# EasyEDA Pro project V0.2-Umbilical-ADXL-1.epro

# Board PCB1
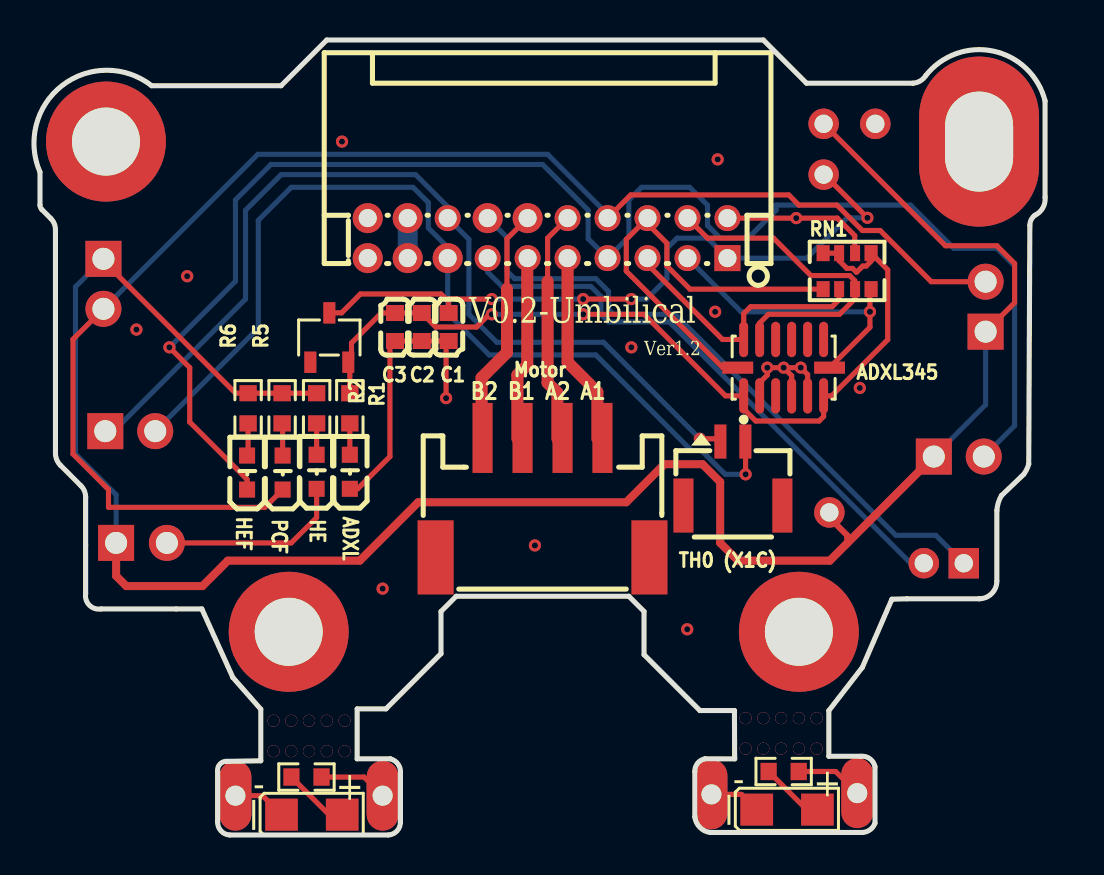
[diagram p0: board, top side]
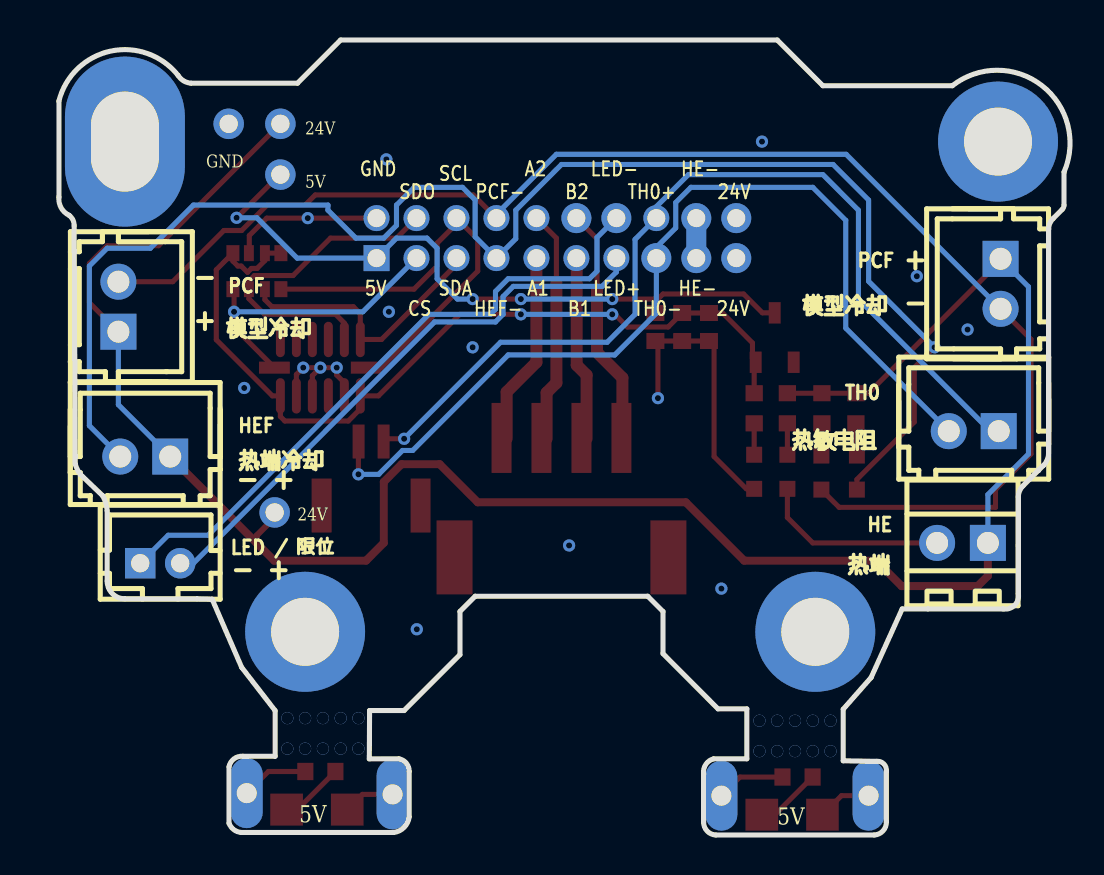
[diagram p1: board, bottom side, seen from below]

Outline 50.6 x 39.75 mm; copper layers: Top Layer, Bottom Layer. Coordinates in mm from the lower left corner of the outline.
Outline path: 0.3,33.15 0.3,31.5 arc(0.32,31.38) 0.39,31.28 0.84,30.83 arc(1.01,30.57) 1.08,30.26 1.08,19.09 arc(1.14,18.76) 1.33,18.49 2.35,17.46 arc(2.53,17.2) 2.59,16.89 2.59,12.06 arc(2.77,11.49) 3.35,11.3 8.4,11.3 9.95,7.87 11.35,6.29 11.35,3.71 9.7,3.68 arc(9.32,3.56) 9.19,3.19 9.19,0.65 arc(9.36,0.2) 9.79,0 17.72,0 arc(18.16,0.2) 18.33,0.64 18.33,3.06 arc(18.22,3.53) 17.83,3.81 16.17,3.81 16.17,6.31 17.61,6.31 20.37,9.07 20.37,11.18 21.13,11.94 29.76,11.94 30.53,11.18 30.53,9.02 33.32,6.22 35.05,6.22 35.06,3.81 33.57,3.81 arc(33.2,3.59) 33.07,3.17 33.07,0.91 arc(33.32,0.38) 33.84,0.13 41.47,0.13 arc(41.85,0.27) 42.08,0.59 42.08,3.41 arc(41.84,3.81) 41.39,3.94 39.77,3.94 39.77,6.22 41.45,8.38 42.93,11.79 43.68,11.81 47.29,11.81 arc(47.92,12.07) 48.18,12.7 48.18,16.22 arc(48.25,16.61) 48.41,16.97 49.53,18.04 arc(49.67,18.28) 49.77,18.55 49.83,30.48 arc(49.9,30.76) 50.08,30.99 arc(50.48,31.36) 50.59,31.89 50.59,36.7 arc(48,39.2) 44.62,37.97 arc(44.35,37.71) 43.99,37.59 38.65,37.59 36.5,39.75 14.65,39.75 12.37,37.47 5.89,37.47 arc(1.42,37.48) 0.3,33.15
Stack: Top Layer 0.035mm / Dielectric1 1.51mm FR4 er 4.5 / Bottom Layer 0.035mm

## Design rules (mm)
template: 自定义配置
spacing copperThickness1oz (default): track to track 0.102, other pairs 0.152 to 0.3
spacing copperThickness2oz: track to track 0.203, other pairs 0.152 to 0.3
track width copperThickness1oz (default): min 0.127, default 0.254, max 2.54
track width copperThickness2oz: min 0.203, default 0.254, max 2.54
differential pair differentialPair (default): width min 0.127, default 0.254, max 2.54; gap min 0.152, default 0.152
via viaSize (default): diameter min 0.5, default 0.61, max 10; hole min 0.3, default 0.305, max 6.3

## Placement (name value [footprint] x y rotation side)
ADXL345  ADXL345BCCZ  [LGA-14_L5.0-W3.0-P0.80-BL]  37.51 23.37 0 top
C1  4.7uF  [C0603]  20.75 25.4 90 top
C2  10uF  [C0603]  19.41 25.4 90 top
C3  100nF  [C0603]  18.07 25.4 90 top
CN1  M2026R-2x10P  [conn-th_10p-m2026r-2-10p]  25.7 29.84 0 top
HE  DB125-2.54-2P-GN-S  [CONN-TH_DB125-2.54-2P-GN]  5.38 14.61 0 bottom
HEF  HX25003-2A  [CONN-TH_2P-P2.50_HX25003-2A]  46.27 18.92 0 bottom
LED1  NCD0603R3  [LED0603-R-RD_RED]  15.8 18.16 90 top
LED2  NCD0603R3  [LED0603-R-RD_RED]  14.14 18.16 90 top
LED3  NCD1206Y1  [LED1206-RD]  13.91 1.02 0 top
LED4  NCD1206Y1  [LED1206-RD]  37.68 1.27 0 top
LED5  NCD0603R3  [LED0603-R-RD_RED]  12.44 18.12 90 top
LED6  NCD0603R3  [LED0603-R-RD_RED]  10.66 18.12 90 top
LED / 限位  HDGC2001WV-2P  [CONN-TH_2P-P2.00_HDGC_HDGC2001WV-2P]  45.52 13.59 180 bottom
Motor  S4B-PH-SM4-TB(LF)(SN)  [CONN-SMD_S4B-PH-SM4-TB-LF-SN]  25.45 16.87 180 top
NOREF  -  [Pad_e99]  33.9 2.03 0 top
NOREF#2  -  [Pad_e43]  3.6 34.67 0 top
NOREF#3  -  [Pad_e1]  42.1 35.56 0 top
NOREF#4  -  [Pad_e44]  47.29 34.67 0 top
NOREF#5  -  [Pad_e39]  12.75 10.16 0 top
NOREF#6  -  [Pad_e4]  39.51 35.56 0 top
NOREF#7  -  [Pad_e100]  41.19 2.09 0 top
NOREF#8  -  [Pad_e41]  38.27 10.16 0 top
NOREF#9  -  [Pad_e810]  39.51 33.02 0 top
NOREF#10  -  [Pad_e232]  39.8 16.13 0 top
NOREF#11  -  [Pad_e95]  10.08 1.97 0 top
NOREF#12  -  [Pad_e98]  17.45 1.97 0 top
PCF  -  [CONN-TH_2P-P2.50_HX25003-2A]  3.48 27.56 270 bottom
PCF#2  -  [CONN-TH_2P-P2.50_HX25003-2A]  47.62 26.42 90 bottom
R1  1K  [R0603]  15.8 21.34 270 top
R2  10K  [R0603]  14.14 21.34 270 top
R3  470  [R0603]  13.64 2.9 180 top
R4  470  [R0603]  37.51 3.17 180 top
R5  10K  [R0603]  12.42 21.34 270 top
R6  10K  [R0603]  10.71 21.34 270 top
RN1  10kΩ  [RES-ARRAY-SMD_0603-8P-L3.2-W1.6-BL]  40.69 28.19 0 top
TH0  HX25003-2A  [CONN-TH_2P-P2.50_HX25003-2A]  4.82 20.19 0 bottom
TH0 (X1C)  L125WVS-02PW  [CONN-SMD_2P-P1.25_DELON_L125WVS-02PW]  34.97 18.07 0 top
U1  ME6206A33XG  [SOT-23-3_L2.9-W1.6-P1.90-LS2.8-BR]  14.78 24.87 270 top

## Footprints (pads in the part's own frame, mm; a bottom-side part is the same pattern mirrored in y, then rotated)
C0603
  rect 0.8x0.9 smd: 1(-0.7,0) 2(0.7,0)
CONN-SMD_2P-P1.25_DELON_L125WVS-02PW
  rect 0.6x1.7 smd: 1(-0.625,1.6) 2(0.625,1.6)
  rect 1x2.7 smd: 3(2.475,-1.6) 4(-2.475,-1.6)
CONN-SMD_S4B-PH-SM4-TB-LF-SN
  rect 1x3.5 smd: 1(3,-2.987) 2(1,-2.987) 3(-1,-2.987) 4(-3,-2.987)
  rect 1.8x3.7 smd: 5(-5.35,2.987) 6(5.35,2.987)
CONN-TH_2P-P2.00_HDGC_HDGC2001WV-2P
  rect 1.524x1.524 hole 0.914: 1(-1,0)
  round 1.524 hole 0.914: 2(1,0)
CONN-TH_2P-P2.50_HX25003-2A
  rect 1.8x1.8 hole 1.1: 1(-1.25,0)
  round 1.8 hole 1.1: 2(1.25,0)
conn-th_10p-m2026r-2-10p
  rect 1.3x1.3 hole 0.9: 1(9,-1)
  round 1.3 hole 0.9: 2(9,1) 3(7,-1) 4(7,1) 5(5,-1) 6(5,1) 7(3,-1) 8(3,1) 9(1,-1) 10(1,1) 11(-1,-1) 13(-3,-1) 16(-5,1)
  round 1.5 hole 0.9: 12(-1,1) 14(-3,1) 15(-5,-1) 17(-7,-1) 18(-7,1) 19(-9,-1) 20(-9,1)
CONN-TH_DB125-2.54-2P-GN
  rect 1.8x1.8 hole 1.1: 1(-1.27,0)
  round 1.8 hole 1.1: 2(1.27,0)
LED0603-R-RD_RED
  rect 0.8x0.8 smd: 1(0.851,0) 2(-0.851,0)
LED1206-RD
  rect 1.635x1.6 smd: 1(-1.518,0) 2(1.518,0)
LGA-14_L5.0-W3.0-P0.80-BL
  oval 0.448x1.769 smd: 1(-2,-1.409) 2(-1.2,-1.409) 3(-0.4,-1.409) 4(0.4,-1.409) 5(1.2,-1.409) 6(2,-1.409) 8(2,1.409) 9(1.2,1.409) 10(0.4,1.409) 11(-0.4,1.409) 12(-1.2,1.409) 13(-2,1.409)
  rect 1.545x0.6 smd: 7(2.297,0) 14(-2.297,0)
Pad_e1
  round 1.524 hole 0.914: 22(0,0)
Pad_e4
  round 1.524 hole 0.914: 23(0,0)
Pad_e39
  round 6 hole 3.4: 1(0,0)
Pad_e41
  round 6 hole 3.4: 1(0,0)
Pad_e43
  round 6 hole 3.4: 1(0,0)
Pad_e44
  oval 6x8.5 hole 3.4x5: 1(0,0)
Pad_e95
  rrect 1.6x3.5 hole 1: 21(0,0)
Pad_e98
  rrect 1.6x3.5 hole 1: 21(0,0)
Pad_e99
  rrect 1.6x3.5 hole 1: 21(0,0)
Pad_e100
  rrect 1.6x3.5 hole 1: 21(0,0)
Pad_e232
  round 1.524 hole 0.914: 23(0,0)
Pad_e810
  round 1.524 hole 0.914: 24(0,0)
R0603
  rect 0.806x0.864 smd: 1(-0.753,0) 2(0.753,0)
RES-ARRAY-SMD_0603-8P-L3.2-W1.6-BL
  rect 0.65x0.8 smd: 1(-1.2,-0.9) 4(1.2,-0.9) 5(1.2,0.9) 8(-1.2,0.9)
  rect 0.5x0.8 smd: 2(-0.4,-0.9) 3(0.4,-0.9) 6(0.4,0.9) 7(-0.4,0.9)
SOT-23-3_L2.9-W1.6-P1.90-LS2.8-BR
  rect 1.07x0.6 smd: 1(1.235,-0.95) 2(1.235,0.95) 3(-1.235,0)

## Nets
3V3: ADXL345.1 ADXL345.6 C2.2 C3.2 R1.1 RN1.5 RN1.7 RN1.8 U1.2
24V: CN1.19 CN1.20 HE.1 HEF.1 NOREF#6.23 NOREF#10.23 PCF.1 PCF#2.1 R2.1 R5.1 R6.1
+5V: C1.2 CN1.1 NOREF#9.24 U1.3
GND: ADXL345.2 ADXL345.4 ADXL345.5 C1.1 C2.1 C3.1 CN1.2 LED1.2 NOREF#3.22 RN1.6 U1.1
+: NOREF#7.21 NOREF#12.21 R3.1 R4.1
-: LED3.1 LED4.1 NOREF.21 NOREF#11.21
A1: CN1.9 Motor.4
A2: CN1.10 Motor.3
B1: CN1.11 Motor.2
B2: CN1.12 Motor.1
CS: ADXL345.7 CN1.3 RN1.4
HE-: CN1.17 CN1.18 HE.2 LED2.2
HEF-: CN1.7 HEF.2 LED6.2
LED+: CN1.13 LED / 限位.2
LED-: CN1.14 LED / 限位.1
PCF-: CN1.8 LED5.2 PCF.2 PCF#2.2
SCL: ADXL345.14 CN1.6 RN1.1
SDA: ADXL345.13 CN1.5 RN1.2
SDO: ADXL345.12 CN1.4 RN1.3
TH0+: CN1.16 TH0.1 TH0 (X1C).1
TH0-: CN1.15 TH0.2 TH0 (X1C).2
$1N2303: LED1.1 R1.2
$1N2329: LED2.1 R2.2
$1N2496: LED3.2 R3.2
$1N2522: LED4.2 R4.2
$1N2656: LED5.1 R5.2
$1N2658: LED6.1 R6.2

Pads without a net: ADXL345 3 8 9 10 11; Motor 5 6; NOREF#2 1; NOREF#4 1; NOREF#5 1; NOREF#8 1; TH0 (X1C) 3 4

## Via types
v1: diameter 0.6, hole 0.6, Top Layer to Bottom Layer, 20 vias
v2: diameter 0.61, hole 0.305, Top Layer to Bottom Layer, 25 vias

## Routing (per net, layer and track width the routed paths; a pad name or vN(x,y) marks a point on that pad's centre or on a via; arc(x,y) is an arc through that point)
3V3: length 43.8
  Top Layer w0.254: v2(27.48,26.04) 30.53,26.04 34.6,21.96 ADXL345.1 35.51,21.3 36.11,20.7 39.29,20.7 39.51,20.92 ADXL345.6 39.91,21.96 42.72,24.77 42.72,28.26 RN1.5 41.89,28.69 41.64,28.45 41.47,28.45 41.17,28.15 41.14,28.15 40.96,28.33 40.68,28.33 40.29,28.72 RN1.7 RN1.8 ; R1.1 15.8,23.56 U1.2 15.89,23.8 15.89,24.61 17.38,26.1 C3.2 C2.2 20.11,25.4 22.14,25.4 22.78,26.04 v2(22.91,26.04)
  Bottom Layer w0.254: v2(22.91,26.04) v2(27.48,26.04)
24V: length 106.1
  Top Layer w0.254: PCF#2.1 49.07,26.62 49.07,28.58 48.18,29.46 45.61,29.46 NOREF#6.23 ; R2.1 R5.1 R6.1 10.09,22.09 3.37,28.81 PCF.1
  Top Layer w0.3: 40.69,14.59 40.69,14.98 40.05,15.62 39.51,15.62
  Top Layer w0.4: HEF.1 39.82,13.72 35.23,13.72 34.34,14.61 34.34,17.65 33.45,18.54 31.54,18.54 29.64,16.64 19.22,16.64 16.3,13.72 9.7,13.72 8.43,12.45 4.62,12.45 4.11,12.95 HE.1
  Bottom Layer w0.254: HE.1 4.11,17.02 2.08,19.05 2.08,27.41 PCF.1 ; HEF.1 47.62,21.52 PCF#2.1
+5V: length 34.7
  Top Layer w0.254: v2(22.91,26.8) 20.62,26.8 ; 20.62,26.8 20.37,27.05 16.33,27.05 15.39,26.11 U1.3 ; 20.62,26.8 20.75,26.67 C1.2 ; NOREF#9.24 39.54,33.02 v2(41.7,30.86) ; v2(29.89,26.8) v2(27.48,26.8)
  Bottom Layer w0.254: v2(29.89,26.8) 30.65,26.8 31.67,27.81 31.67,29.34 32.18,29.84 33.7,29.84 CN1.1 38.67,28.84 40.69,30.86 v2(41.7,30.86) ; v2(22.91,26.8) v2(27.48,26.8)
GND: length 28.1
  Top Layer w0.254: CN1.2 v2(38.14,30.84) 40.19,30.84 41.07,29.97 41.07,29.11 RN1.6 ; 36.31,21.96 36.31,22.62 36.69,23 v2(36.69,23.37) v2(37.51,23.37) ; LED1.2 16.2,17.31 17.81,18.92 17.81,24.45 C3.1 C2.1 C1.1 20.62,24.57 v2(20.62,21.84) ; 37.91,21.96 37.91,22.97 v2(37.51,23.37) ; v2(37.51,23.37) v2(38.37,23.37) 38.71,23.02 ADXL345.5
  vias: v2(5.13,25.27) v2(7.67,27.94) v2(15.41,34.67) v2(17.45,12.32) v2(25.07,14.48) v2(29.89,24.38) v2(32.69,10.29) v2(34.08,26.16) v2(34.21,33.78) v2(41.32,22.35)
(no net):
  vias: v1(11.98,5.72) v1(11.98,4.19) v1(12.87,5.72) v1(12.87,4.19) v1(13.76,5.72) v1(13.76,4.19) v1(14.65,5.72) v1(14.65,4.19) v1(15.54,5.72) v1(15.54,4.19) v1(35.61,5.84) v1(35.61,4.32) v1(36.5,5.84) v1(36.5,4.32) v1(37.38,5.84) v1(37.38,4.32) v1(38.27,5.84) v1(38.27,4.32) v1(39.16,5.84) v1(39.16,4.32)
+: length 6.8
  Top Layer w0.254: R3.1 16.51,2.9 NOREF#12.21 ; R4.1 40.11,3.17 NOREF#7.21
-: length 5.3
  Top Layer w0.254: LED4.1 35.4,2.03 NOREF.21 ; NOREF#11.21 11.44,1.97 LED3.1
A1: length 9.6
  Top Layer w0.6: CN1.9 26.7,23.64 28.19,22.15 28.19,19.82
A2: length 11.6
  Top Layer w0.254: CN1.10 25.7,29.84 25.7,27.69
  Top Layer w0.6: 26.19,19.82 26.19,22.12 25.7,22.61 25.7,27.69
B1: length 9.2
  Top Layer w0.6: 24.19,19.82 24.19,23 24.68,23.5 24.68,28.83 CN1.11
B2: length 11.8
  Top Layer w0.254: CN1.12 23.67,29.81 23.67,27.31
  Top Layer w0.6: 22.4,20.03 22.4,22.86 23.67,24.13 23.67,27.31
CS: length 15
  Top Layer w0.254: ADXL345.7 41.83,25.39 v2(41.83,26.16) 41.83,27.24 RN1.4
  Bottom Layer w0.254: v2(41.83,26.16) 35.38,26.16 CN1.3
HE-: length 11.5
  Top Layer w0.254: LED2.2 14.14,15.88 12.87,14.61 HE.2
  Bottom Layer w1: CN1.18 CN1.17
HEF-: length 76.4
  Top Layer w0.254: v2(6.78,24.38) 7.79,23.37 7.79,20.65 10.66,17.78 LED6.2
  Bottom Layer w0.254: HEF.2 49.07,20.47 49.07,28.45 48.18,29.34 46.02,29.34 43.86,31.5 37.13,31.5 37.13,31.24 35.73,29.84 34.34,29.84 33.7,30.48 33.7,31.5 32.81,32.39 30.4,32.39 29.76,31.75 29.76,29.91 CN1.7 27.73,29.81 27.73,31.24 25.45,33.53 11.86,33.53 10.08,31.75 10.08,27.69 v2(6.78,24.38)
LED+: length 29.1
  Bottom Layer w0.254: LED / 限位.2 43.86,13.59 31.8,25.65 28.75,25.65 28.37,26.04 28.37,26.92 27.86,27.43 23.41,27.43 22.7,28.15 CN1.13
LED-: length 32.5
  Bottom Layer w0.254: CN1.14 23.67,29.88 23.67,28.19 24.05,27.81 28.11,27.81 28.75,27.18 28.75,26.29 29,26.04 32.08,26.04 43.13,14.99 45.13,14.99 LED / 限位.1
PCF-: length 71.4
  Top Layer w0.254: LED5.2 11.55,16.38 3.73,16.38 3.73,17.27 1.95,19.05 1.95,24.79 PCF.2 ; CN1.8 29.86,32 37.77,32 38.27,31.5 40.18,31.5 41.45,30.23 42.34,30.23 44.9,27.67 PCF#2.2
  Bottom Layer w0.254: CN1.8 28.7,31.04 25.7,34.04 11.2,34.04 PCF.2
SCL: length 21.8
  Top Layer w0.254: ADXL345.14 34.46,23.37 29.64,28.19 29.64,29.78 CN1.6 30.7,30.56 31.67,29.59 31.67,28.45 32.82,27.29 RN1.1
SDA: length 13.6
  Top Layer w0.254: CN1.5 30.7,28.53 34.45,24.78 ADXL345.13 35.51,26.07 35.86,26.42 39.94,26.42 40.29,26.77 RN1.2
SDO: length 16.7
  Top Layer w0.254: CN1.4 33.7,29.84 37,29.84 38.88,27.97 40.81,27.97 41.07,27.72 41.07,27.31 RN1.3 41.09,26.82 40.31,26.04 36.75,26.04 36.31,25.6 36.31,24.78
TH0+: length 46.7
  Top Layer w0.254: 34.35,19.89 34.27,19.81 v2(33.32,19.81)
  Bottom Layer w0.254: v2(33.32,19.81) 28.49,24.64 23.16,24.64 21.76,26.04 21.76,29.78 CN1.16 20.7,31.42 19.1,33.02 12.36,33.02 10.59,31.24 10.59,26.8 3.98,20.19 TH0.1
TH0-: length 48.2
  Top Layer w0.254: v2(35.61,18.03) 35.61,19.88 35.6,19.89
  Bottom Layer w0.254: TH0.2 11.22,25.35 11.22,30.73 12.87,32.39 18.97,32.39 19.73,31.62 19.73,30.35 20.7,29.38 CN1.15 20.7,26.08 22.78,24 28.11,24 32.89,19.23 33.4,19.23 34.59,18.03 v2(35.61,18.03)
$1N2303: length 1.6
  Top Layer w0.254: R1.2 LED1.1
$1N2329: length 1.6
  Top Layer w0.254: R2.2 LED2.1
$1N2496: length 3.3
  Top Layer w0.254: LED3.2 14.76,1.02 R3.2
$1N2522: length 3.2
  Top Layer w0.254: LED4.2 38.66,1.27 R4.2
$1N2656: length 1.6
  Top Layer w0.254: R5.2 12.44,20.56 LED5.1
$1N2658: length 1.6
  Top Layer w0.254: LED6.1 10.71,19.02 R6.2

## Copper pours and planes (outline as drawn; the poured copper is in the pictures)
24V on Bottom Layer: 13,31.88 11.86,30.73 11.86,19.18 10.71,18.03 4.11,18.03 3.22,17.15 3.22,13.71 4.96,13.71 4.96,15.28 5.62,15.93 13.18,15.93 17.45,20.19 17.45,31.5 17.06,31.88
GND on Top Layer: -4.27,43.43 52.81,43.43 52.81,6.35 -4.27,6.35
GND on Bottom Layer: -2.49,42.04 50.08,42.04 50.08,6.1 -2.49,6.1
HE- on Bottom Layer: 17.83,29.54 19.6,29.54 19.6,17.02 16.56,13.97 9.32,13.97 8.43,13.08 5.36,13.08 5.63,13.35 5.63,15.11 6.14,15.62 13.38,15.62 17.83,20.07

## Text on the board
Bottom Solder Mask Layer: IX_ | 九维造物 | V0.2-Umbilical
Bottom Silkscreen Layer: 24V | HE- | TH0- | TH0+ | LED+ | LED- | B1 | B2 | A1 | A2 | PCF- | HEF- | SCL | SDA | CS | SDO | 5V | GND | + | - | + - | - + | 热端 | 模型冷却 | 热敏电阻 | 热端冷却
Top Silkscreen Layer: HEF | PCF | HE | ADXL | B2 B1 A2 A1 | Ver1.2 | - | + | V0.2-Umbilical
